# Altium project MJE13001_SWITCHING_WITH_FEEDBACK_V2.PrjPcb
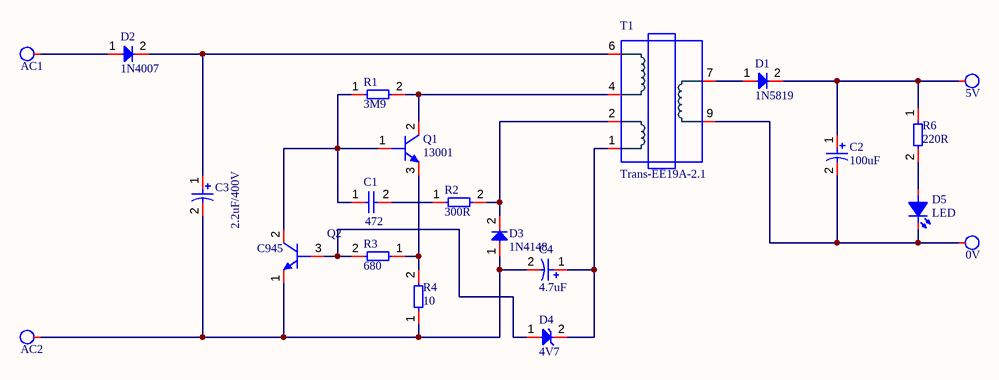
[diagram p0: MJE13001_SWITCHING_WITH_FEEDBACK_V2.SchDoc]
1 sheet, 21 parts. Net scope: global (net labels, ports and power ports of the same name join across sheets).
Board files: MJE13001_SWITCHING_WITH_FEEDBACK_V2.PcbDoc, PCB1.PcbDoc

## Sheet MJE13001_SWITCHING_WITH_FEEDBACK_V2.SchDoc: MJE13001_SWITCHING
size A4; ApprovedBy: PHẠM VĂN LẬP; Author: PHẠM VĂN LẬP; Revision: V1.2; SheetNumber: 1; SheetTotal: 1

### Parts
0V  SolderPoint  [SolderPoint]  (value not drawn)
5V  SolderPoint  [SolderPoint]  (value not drawn)
AC1  SolderPoint  [SolderPoint]  (value not drawn)
AC2  SolderPoint  [SolderPoint]  (value not drawn)
C1  472  [CAP_Ceramic_Disc_2]
C2  100uF  [CAP_RAD_2.5mm]
C3  2.2uF/400V  [CAP_RAD_3.5mm]
C4  4.7uF  [CAP_RAD_2.5mm]
D1  1N5819  [DO-41]
D2  1N4007  [DO-41]
D3  1N4148  [DO-35 Horizontal]
D4  4V7  [DO-35 Horizontal]
D5  LED  [LED_3MM_RED]
Q1  13001  [TO-92]
Q2  C945  [TO-92]
R1  3M9  [RES-0.25W-H-MF]
R2  300R  [RES-0.25W-H-MF]
R3  680  [RES-0.25W-H-MF]
R4  10  [RES-0.25W-H-MF]
R6  220R  [RES-0.25W-H-MF]
T1  Trans-EE19A-2.1  [TRANS_EE19A-2.1]

### Nets
Net0V_1: 0V.1 C2.2 D5.2(K) T1.9
Net5V_1: 5V.1 C2.1 D1.2 R6.1
NetAC1_1: AC1.1 D2.1
NetAC2_1: AC2.1 C3.2 C4.2 D3.1 Q2.1(E) R4.1
NetC1_1: C1.1 Q1.1(B) Q2.2(C) R1.1
NetC1_2: C1.2 R2.1
NetC3_1: C3.1 D2.2 T1.6
NetC4_1: C4.1 D4.2 T1.1
NetD1_1: D1.1 T1.7
NetD3_2: D3.2 R2.2 T1.2
NetD4_1: D4.1 Q2.3(B) R3.2
NetD5_1: D5.1(A) R6.2
NetQ1_2: Q1.2(C) R1.2 T1.4
NetQ1_3: Q1.3(E) R3.1 R4.2

### Library data of the parts
C1 = Capacitors(Disc)
C2-C4 = Capacitor(Radian)
D1 = 1N4937
D3 = Diode 1N4148
D4 = Diode Zener
D5 = LED 3MM
Q1 = MJE13001_Type_F
R1-R4 R6 = Resistors THD